# Altium schematic sheet block.SchDoc
size 297 x 209 mm; Address1: Address1; Address2: Address2; Address3: Address3; Address4: Address4; SheetNumber: 1; Scale: 1:1; Обозначение документа: АБВГ.123456.001Э3
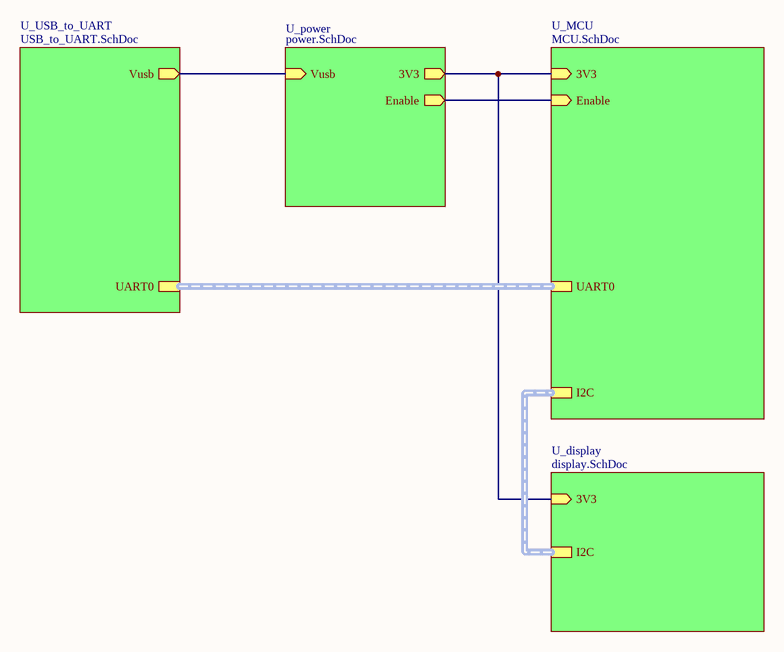
[diagram p0: block.SchDoc]

## Sub-sheets
U_display = display.SchDoc: I2C (harness I2C), 3V3 (in)
U_MCU = MCU.SchDoc: I2C (harness I2C), 3V3 (in), Enable (in), UART0
U_power = power.SchDoc: 3V3 (out), Enable (out), Vusb (in)
U_USB_to_UART = USB_to_UART.SchDoc: Vusb (out), UART0 (harness UART0)

## Nets
(unnamed): sheet U_MCU/3V3, sheet U_power/3V3, sheet U_display/3V3
(unnamed): sheet U_MCU/Enable, sheet U_power/Enable
(unnamed): sheet U_power/Vusb, sheet U_USB_to_UART/Vusb

## Buses and harness runs
harness sheet U_display/I2C = sheet U_MCU/I2C
harness sheet U_MCU/UART0 = sheet U_USB_to_UART/UART0

## Notes on the sheet
- Подп. и дата
- Инв. № дубл.
- Взам. инв. №
- Инв. № подл.
- Изм.
- Лист
- № докум.
- Подп.
- Дата
- Копировал
- Формат А4